# Altium project Blue Pill Clock.PrjPcb
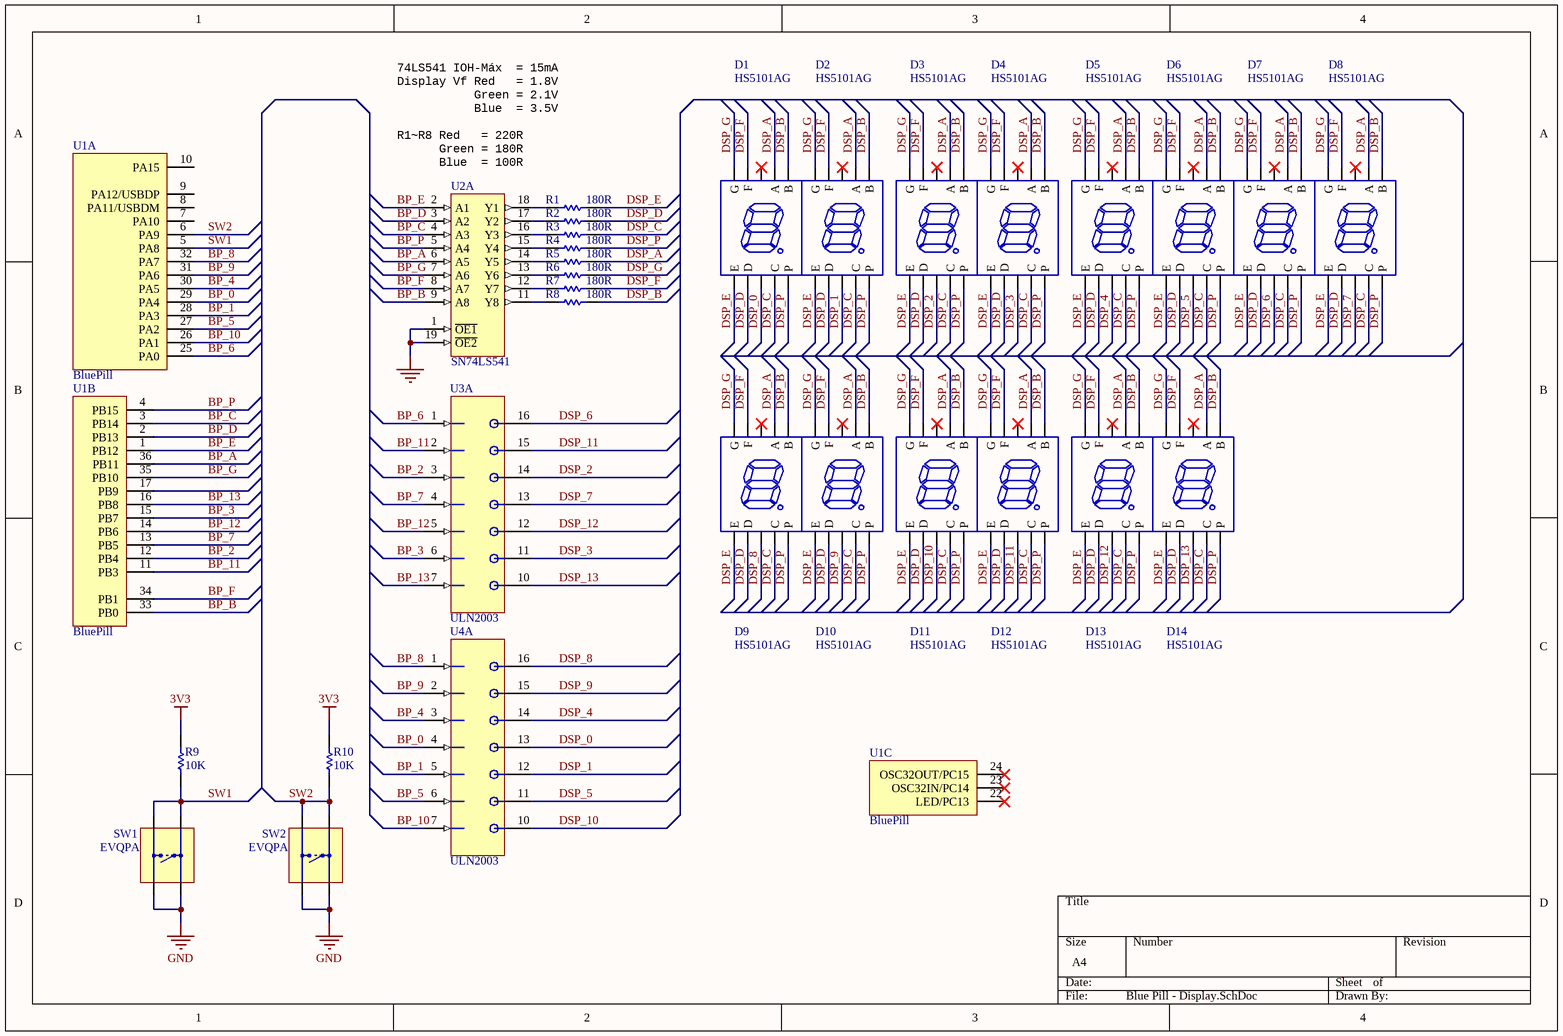
[diagram p0: Blue Pill - Display.SchDoc]
2 sheets, 37 parts. Net scope: global (net labels, ports and power ports of the same name join across sheets).
Board file: Blue Pill Clock.PcbDoc
Sheets:
  Blue Pill - Display.SchDoc
  Blue Pill - Power.SchDoc

## Sheet Blue Pill - Display.SchDoc
size A4

### Parts
D1  HS5101AG  [HS5101AG]
D2  HS5101AG  [HS5101AG]
D3  HS5101AG  [HS5101AG]
D4  HS5101AG  [HS5101AG]
D5  HS5101AG  [HS5101AG]
D6  HS5101AG  [HS5101AG]
D7  HS5101AG  [HS5101AG]
D8  HS5101AG  [HS5101AG]
D9  HS5101AG  [HS5101AG]
D10  HS5101AG  [HS5101AG]
D11  HS5101AG  [HS5101AG]
D12  HS5101AG  [HS5101AG]
D13  HS5101AG  [HS5101AG]
D14  HS5101AG  [HS5101AG]
R1  180R  [0805]
R2  180R  [0805]
R3  180R  [0805]
R4  180R  [0805]
R5  180R  [0805]
R6  180R  [0805]
R7  180R  [0805]
R8  180R  [0805]
R9  10K  [0805]
R10  10K  [0805]
SW1  EVQPA  [EVQPAx09K]
SW2  EVQPA  [EVQPAx09K]
U1  BluePill  [Blue Pill]  (parts A,B,C of 4)
U2  SN74LS541  [PDIP20]  (part A of 2)
U3  ULN2003  [PDIP16]  (part A of 2)
U4  ULN2003  [PDIP16]  (part A of 2)

### Nets
3V3: R9.2 R10.2
GND: SW1.1 SW1.2 SW2.1 SW2.2 U2.1(~{OE1}) U2.19(~{OE2})
BP_0: U1.29(PA4) U4.4
BP_1: U1.28(PA3) U4.5
BP_2: U1.12(PB4) U3.3
BP_3: U1.15(PB7) U3.6
BP_4: U1.30(PA5) U4.3
BP_5: U1.27(PA2) U4.6
BP_6: U1.25(PA0) U3.1
BP_7: U1.13(PB5) U3.4
BP_8: U1.32(PA7) U4.1
BP_9: U1.31(PA6) U4.2
BP_10: U1.26(PA1) U4.7
BP_11: U1.11(PB3) U3.2
BP_12: U1.14(PB6) U3.5
BP_13: U1.16(PB8) U3.7
BP_A: U1.36(PB11) U2.6(A5)
BP_B: U1.33(PB0) U2.9(A8)
BP_C: U1.3(PB14) U2.4(A3)
BP_D: U1.2(PB13) U2.3(A2)
BP_E: U1.1(PB12) U2.2(A1)
BP_F: U1.34(PB1) U2.8(A7)
BP_G: U1.35(PB10) U2.7(A6)
BP_P: U1.4(PB15) U2.5(A4)
DSP_0: D1.3(GND2) U4.13
DSP_1: D2.3(GND2) U4.12
DSP_2: D3.3(GND2) U3.14
DSP_3: D4.3(GND2) U3.11
DSP_4: D5.3(GND2) U4.14
DSP_5: D6.3(GND2) U4.11
DSP_6: D7.3(GND2) U3.16
DSP_7: D8.3(GND2) U3.13
DSP_8: D9.3(GND2) U4.16
DSP_9: D10.3(GND2) U4.15
DSP_10: D11.3(GND2) U4.10
DSP_11: D12.3(GND2) U3.15
DSP_12: D13.3(GND2) U3.12
DSP_13: D14.3(GND2) U3.10
DSP_A: D1.7(A) D2.7(A) D3.7(A) D4.7(A) D5.7(A) D6.7(A) D7.7(A) D8.7(A) D9.7(A) D10.7(A) D11.7(A) D12.7(A) D13.7(A) D14.7(A) R5.2
DSP_B: D1.6(B) D2.6(B) D3.6(B) D4.6(B) D5.6(B) D6.6(B) D7.6(B) D8.6(B) D9.6(B) D10.6(B) D11.6(B) D12.6(B) D13.6(B) D14.6(B) R8.2
DSP_C: D1.4(C) D2.4(C) D3.4(C) D4.4(C) D5.4(C) D6.4(C) D7.4(C) D8.4(C) D9.4(C) D10.4(C) D11.4(C) D12.4(C) D13.4(C) D14.4(C) R3.2
DSP_D: D1.2(D) D2.2(D) D3.2(D) D4.2(D) D5.2(D) D6.2(D) D7.2(D) D8.2(D) D9.2(D) D10.2(D) D11.2(D) D12.2(D) D13.2(D) D14.2(D) R2.2
DSP_E: D1.1(E) D2.1(E) D3.1(E) D4.1(E) D5.1(E) D6.1(E) D7.1(E) D8.1(E) D9.1(E) D10.1(E) D11.1(E) D12.1(E) D13.1(E) D14.1(E) R1.2
DSP_F: D1.9(F) D2.9(F) D3.9(F) D4.9(F) D5.9(F) D6.9(F) D7.9(F) D8.9(F) D9.9(F) D10.9(F) D11.9(F) D12.9(F) D13.9(F) D14.9(F) R7.2
DSP_G: D1.10(G) D2.10(G) D3.10(G) D4.10(G) D5.10(G) D6.10(G) D7.10(G) D8.10(G) D9.10(G) D10.10(G) D11.10(G) D12.10(G) D13.10(G) D14.10(G) R6.2
DSP_P: D1.5(P) D2.5(P) D3.5(P) D4.5(P) D5.5(P) D6.5(P) D7.5(P) D8.5(P) D9.5(P) D10.5(P) D11.5(P) D12.5(P) D13.5(P) D14.5(P) R4.2
SW1: R9.1 SW1.3 SW1.4 U1.5(PA8)
SW2: R10.1 SW2.3 SW2.4 U1.6(PA9)
NetR1_1: R1.1 U2.18(Y1)
NetR2_1: R2.1 U2.17(Y2)
NetR3_1: R3.1 U2.16(Y3)
NetR4_1: R4.1 U2.15(Y4)
NetR5_1: R5.1 U2.14(Y5)
NetR6_1: R6.1 U2.13(Y6)
NetR7_1: R7.1 U2.12(Y7)
NetR8_1: R8.1 U2.11(Y8)

Not connected (* = marked no-connect by the designer): D1 8(GND1)*; D2 8(GND1)*; D3 8(GND1)*; D4 8(GND1)*; D5 8(GND1)*; D6 8(GND1)*; D7 8(GND1)*; D8 8(GND1)*; D9 8(GND1)*; D10 8(GND1)*; D11 8(GND1)*; D12 8(GND1)*; D13 8(GND1)*; D14 8(GND1)*; U1 7(PA10) 8(PA11/USBDM) 9(PA12/USBDP) 10(PA15) 17(PB9) 22(LED/PC13)* 23(OSC32IN/PC14)* 24(OSC32OUT/PC15)*

### Notes on the sheet
- 74LS541 IOH-Máx  = 15mA
  Display Vf Red   = 1.8V
  Green = 2.1V
  Blue  = 3.5V
  R1~R8 Red   = 220R
  Green = 180R
  Blue  = 100R

### Library data of the parts
D1-D14 = HS5101AG: Display 7-Segments Cathodo Common
R1-R10 = Resistor
SW1 SW2 = EVQPA: 5N Type Light Touch Switches
U1 = Blue Pill - Model 1: STM32 Blue Pill
U2 = SN74HC541 Type-2: Octal Buffers and Line Drivers With 3-State Outputs
U3 U4 = UN200x - Model 1: Seven Darlington arrays

## Sheet Blue Pill - Power.SchDoc
size A4
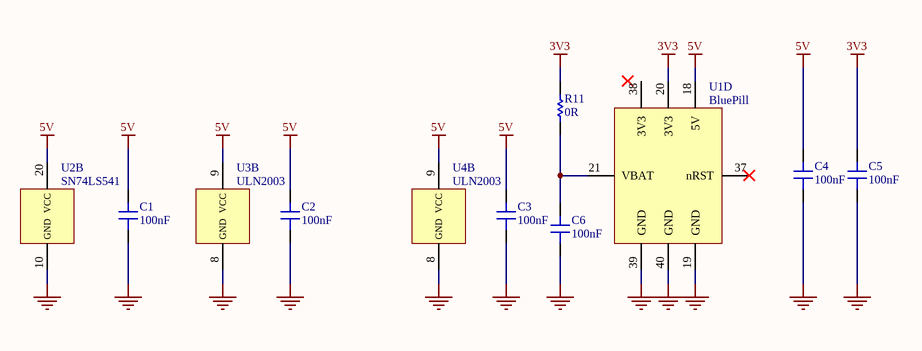
[diagram p1: Blue Pill - Power.SchDoc]

### Parts
C1  100nF  [0805]
C2  100nF  [0805]
C3  100nF  [0805]
C4  100nF  [0805]
C5  100nF  [0805]
C6  100nF  [0805]
R11  0R  [0805]
U1  BluePill  [Blue Pill]  (part D of 4)
U2  SN74LS541  [PDIP20]  (part B of 2)
U3  ULN2003  [PDIP16]  (part B of 2)
U4  ULN2003  [PDIP16]  (part B of 2)

### Nets
3V3: C5.1 R11.2 U1.20(3V3)
5V: C1.1 C2.1 C3.1 C4.1 U1.18(5V) U2.20(VCC) U3.9(VCC) U4.9(VCC)
GND: C1.2 C2.2 C3.2 C4.2 C5.2 C6.2 U1.19(GND) U1.39(GND) U1.40(GND) U2.10(GND) U3.8(GND) U4.8(GND)
NetC6_1: C6.1 R11.1 U1.21(VBAT)

Not connected (* = marked no-connect by the designer): U1 37(nRST)* 38(3V3)

### Library data of the parts
C1-C6 = Capacitor
R11 = Resistor
U1 = Blue Pill - Model 1: STM32 Blue Pill
U2 = SN74HC541 Type-2: as U2 on sheet Blue Pill - Display
U3 U4 = UN200x - Model 1: Seven Darlington arrays

## Nets that join several sheets
3V3: Blue Pill - Display (R9.2 R10.2), Blue Pill - Power (C5.1 R11.2 U1.20)
GND: Blue Pill - Display (6 pins), Blue Pill - Power (12 pins)